# Altium schematic sheet CCLights.schdoc
size A3
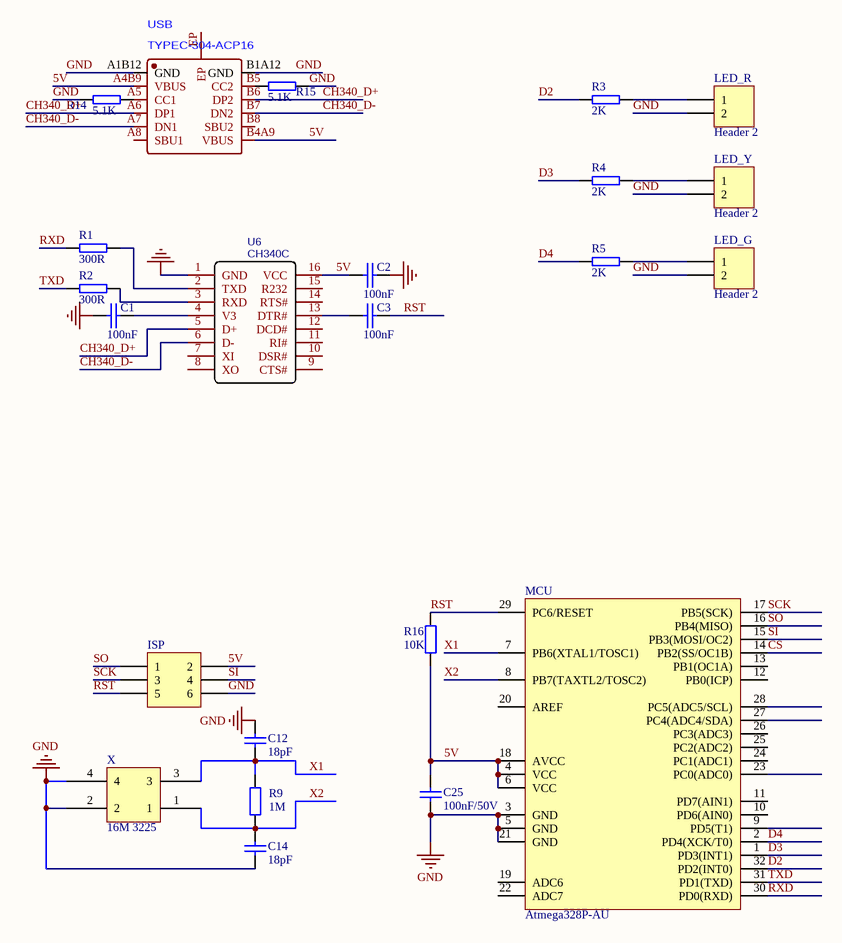
[diagram p0: CCLights.schdoc]

## Parts
C1  100nF  [LC-0603_C]
C2  100nF  [LC-0603_C]
C3  100nF  [LC-0603_C]
C12  18pF  [0603C]
C14  18pF  [0603C]
C25  100nF/50V  [LC-0603_C]
ISP  Header 3X2  [HDR2X3]  (value not drawn)
LED_G  Header 2  [HDR1X2]
LED_R  Header 2  [HDR1X2]
LED_Y  Header 2  [HDR1X2]
MCU  Atmega328P-AU  [LQFP32]
R1  300R  [LC-0603_R]
R2  300R  [LC-0603_R]
R3  2K  [LC-0603_R]
R4  2K  [LC-0603_R]
R5  2K  [LC-0603_R]
R9  1M  [0603R]
R14  5.1K  [LC-0402_R]
R15  5.1K  [LC-0402_R]
R16  10K  [0603R]
U6  CH340C  [SOP-16_L10.0-W3.9-P1.27-LS6.0-BL]
USB  TYPEC-304-ACP16  [USB-C-SMD_TYPE-C-16P-1]
X  16M 3225  [LC-SMD-3225_4P]

## Nets
GND: C1.1 C2.2 C12.1 C14.2 C25.1 ISP.6 LED_G.2 LED_R.2 LED_Y.2 MCU.3(GND) MCU.5(GND) MCU.21(GND) R14.1 R15.2 U6.1(GND) USB.A1B12(GND) USB.B1A12(GND) X.2 X.4
5V: C2.1 C25.2 ISP.2 MCU.4(VCC) MCU.6(VCC) MCU.18(AVCC) R16.2 U6.16(VCC) USB.A4B9(VBUS) USB.B4A9(VBUS)
CH340_D+: U6.5(D+) USB.A6(DP1) USB.B6(DP2)
CH340_D-: U6.6(D-) USB.A7(DN1) USB.B7(DN2)
CS: MCU.14(PB2(SS/OC1B))
D2: MCU.32(PD2(INT0)) R3.2
D3: MCU.1(PD3(INT1)) R4.2
D4: MCU.2(PD4(XCK/T0)) R5.2
RST: C3.2 ISP.5 MCU.29(PC6/RESET) R16.1
RXD: MCU.30(PD0(RXD)) R1.2
SCK: ISP.3 MCU.17(PB5(SCK))
SI: ISP.4 MCU.15(PB3(MOSI/OC2))
SO: ISP.1 MCU.16(PB4(MISO))
TXD: MCU.31(PD1(TXD)) R2.2
X1: C12.2 MCU.7(PB6(XTAL1/TOSC1)) R9.1 X.3
X2: C14.1 MCU.8(PB7(TAXTL2/TOSC2)) R9.2 X.1
NetC1_2: C1.2 U6.4(V3)
NetC3_1: C3.1 U6.13(DTR#)
NetLED_G_1: LED_G.1 R5.1
NetLED_R_1: LED_R.1 R3.1
NetLED_Y_1: LED_Y.1 R4.1
NetR1_1: R1.1 U6.2(TXD)
NetR2_1: R2.1 U6.3(RXD)
NetR14_2: R14.2 USB.A5(CC1)
NetR15_1: R15.1 USB.B5(CC2)

Not connected (* = marked no-connect by the designer): MCU 9(PD5(T1)) 10(PD6(AIN0)) 11(PD7(AIN1)) 12(PB0(ICP)) 13(PB1(OC1A)) 19(ADC6) 20(AREF) 22(ADC7) 23(PC0(ADC0)) 24(PC1(ADC1)) 25(PC2(ADC2)) 26(PC3(ADC3)) 27(PC4(ADC4/SDA)) 28(PC5(ADC5/SCL)); U6 7(XI) 8(XO) 9(CTS#) 10(DSR#) 11(RI#) 12(DCD#) 14(RTS#) 15(R232); USB A8(SBU1) B8(SBU2) EP

## Library data of the parts
C1-C3 = CAP: Capacitor
C12 C14 C25 = Cap: Capacitor; Value: 0.01uF; Published: 8-Jun-2000; LatestRevisionDate: 17-Jul-2002; LatestRevisionNote: Re-released for DXP Platform.; PackageReference: RAD-0.3; Publisher: Altium Limited; PackageDescription: Radial Cap, Thru-Hole; 2 Leads; 0.3 in Pin Spacing
ISP = Header 3X2: Header, 3-Pin, Dual row; LatestRevisionDate: 17-Jul-2002; LatestRevisionNote: Re-released for DXP Platform.; Publisher: Altium Limited
LED_G LED_R LED_Y = Header 2: Header, 2-Pin; LatestRevisionDate: 17-Jul-2002; LatestRevisionNote: Re-released for DXP Platform.; Publisher: Altium Limited
R1-R5 R14 R15 = RES2
R9 R16 = Res2: Resistor; Value: 4K7; Published: 8-Jun-2000; LatestRevisionDate: 17-Jul-2002; LatestRevisionNote: Re-released for DXP Platform.; PackageReference: AXIAL-0.4; Publisher: Altium Limited; PackageDescription: Axial Device, Thru-Hole; 2 Leads; 0.4 in Pin Spacing
U6 = CH340C: BOM_Manufacturer: WCH; SMT Type: Extend; BOM_Supplier: LCSC; BOM_Manufacturer Part: CH340C; BOM_Supplier Part: C84681; BOM_LCSC Assembly: Yes; spicePre: U; spiceSymbolName: CH340C
X = Component_1: 16M_SMD_3225